# EAGLE design PiKVM_USB_Adapter v1.6 (EAGLE 9.6.2)
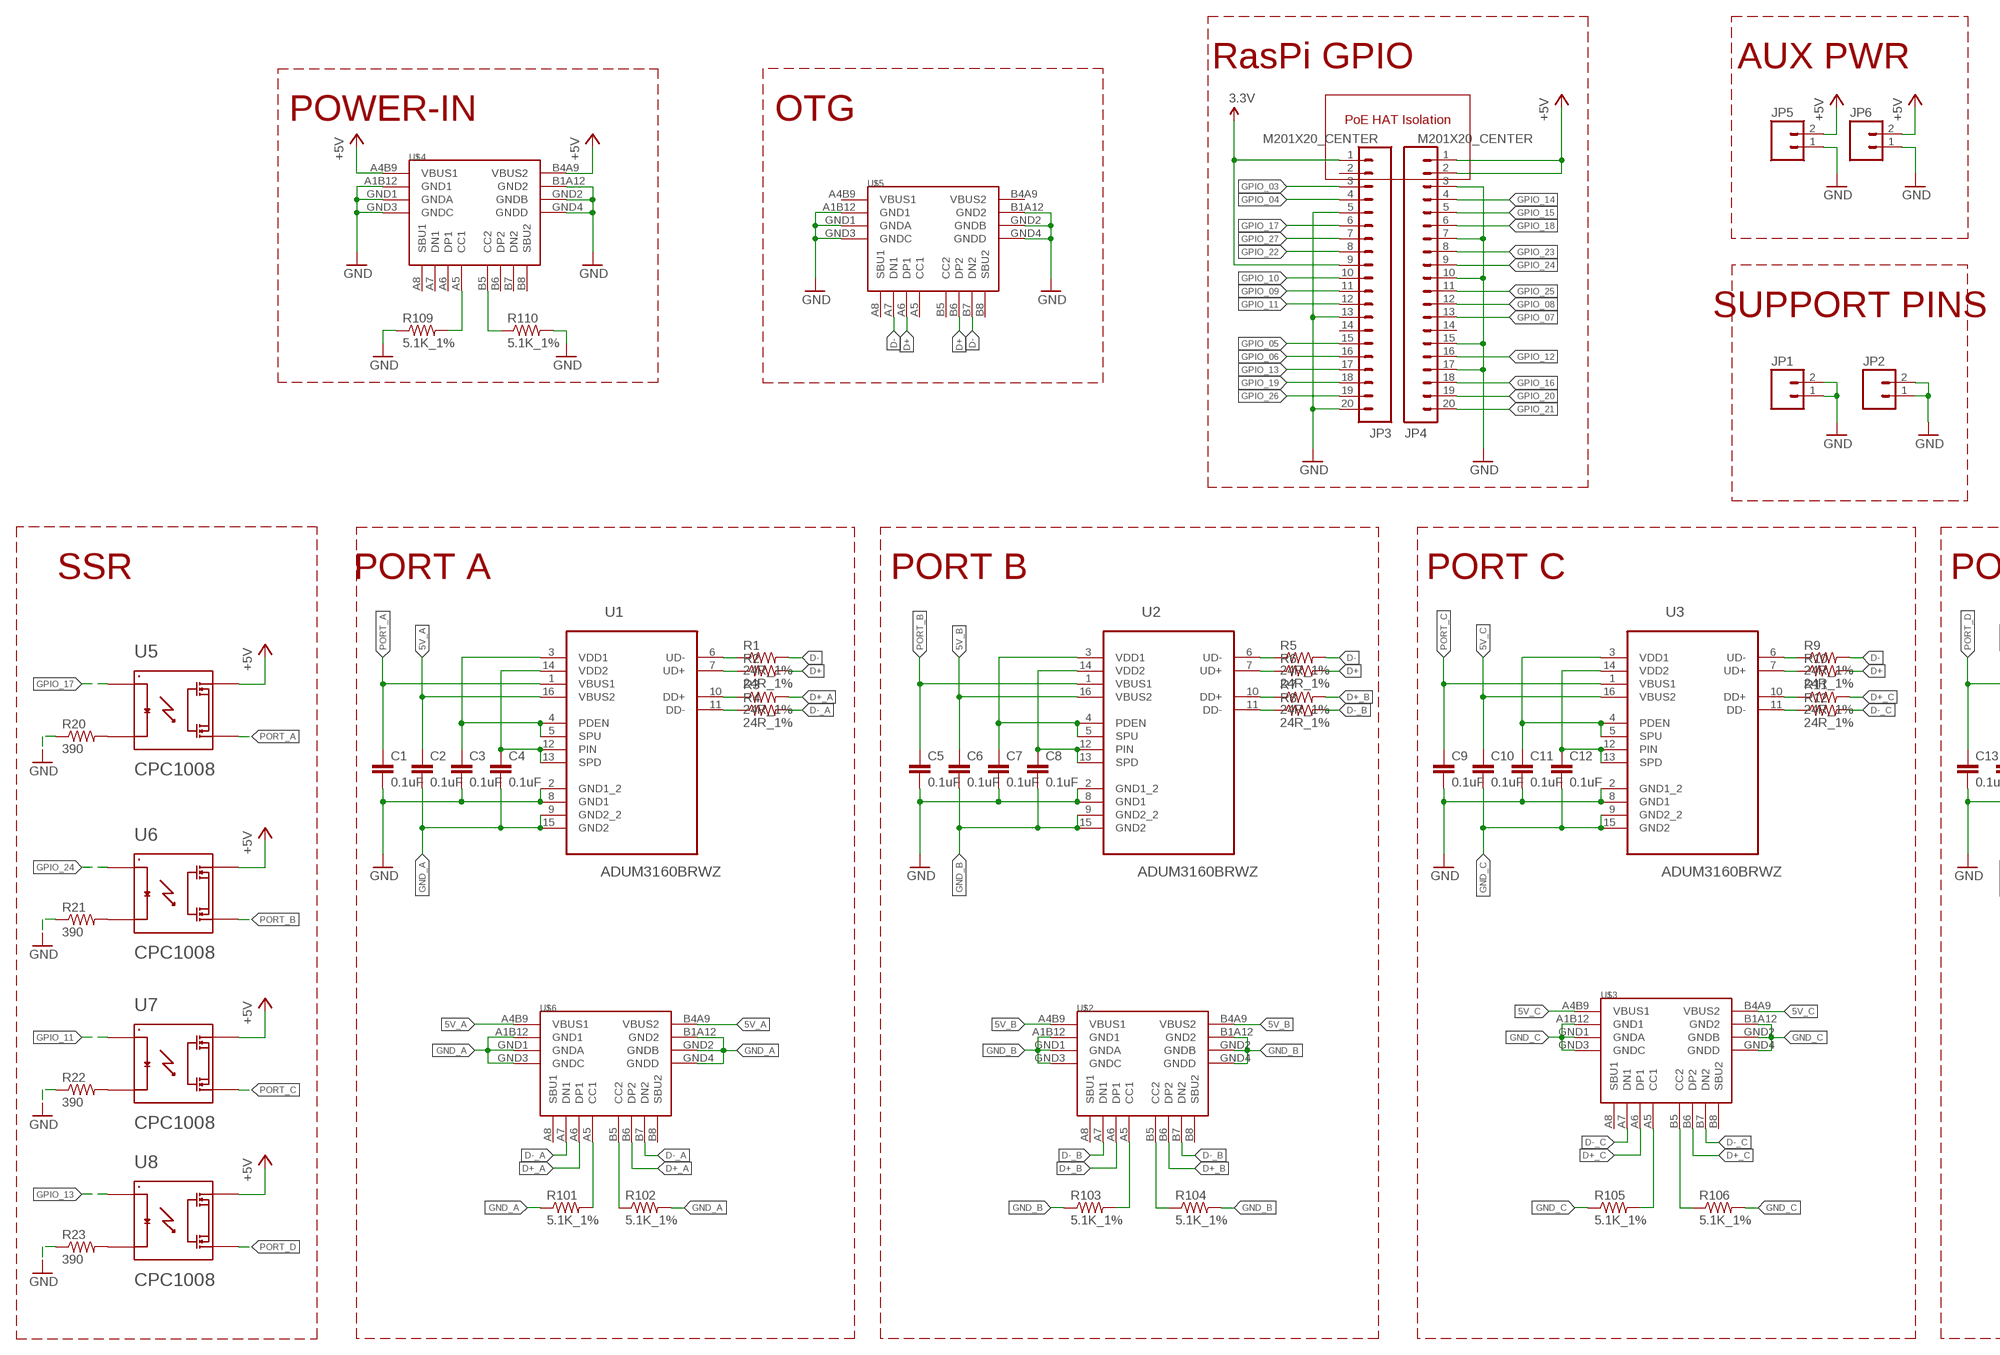
[diagram p0: schematic, sheet 1, part 1 of 2]
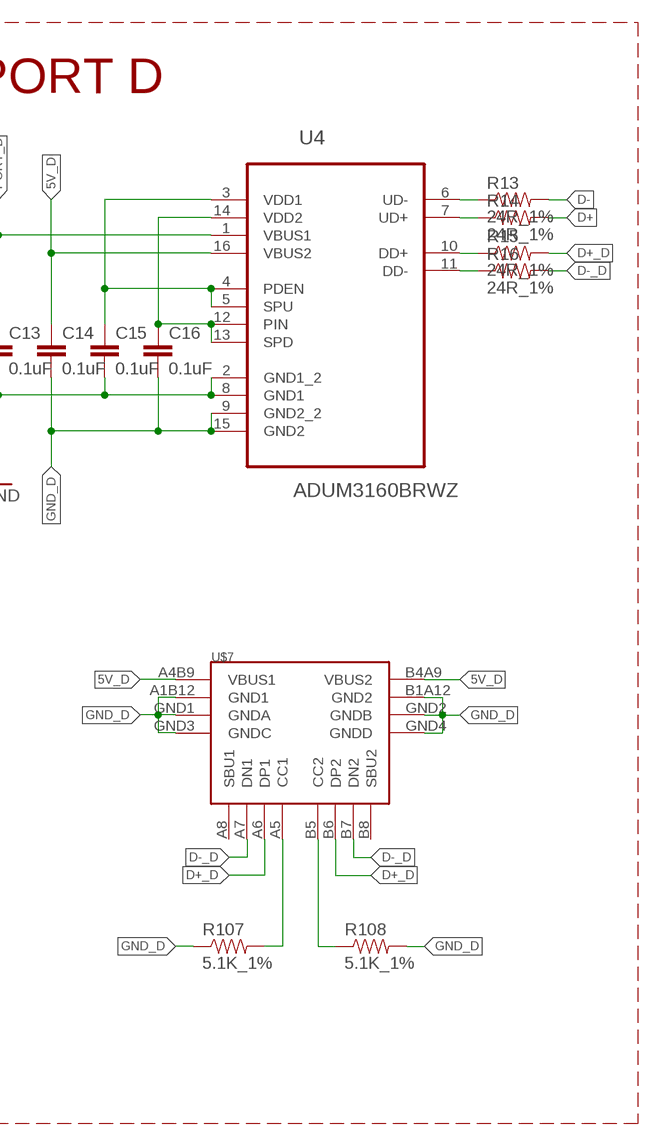
[diagram p1: schematic, sheet 1, part 2 of 2]

## Parts
C1  0.1uF  CAP0805  [0805]
C2  0.1uF  CAP0805  [0805]
C3  0.1uF  CAP0805  [0805]
C4  0.1uF  CAP0805  [0805]
C5  0.1uF  CAP0805  [0805]
C6  0.1uF  CAP0805  [0805]
C7  0.1uF  CAP0805  [0805]
C8  0.1uF  CAP0805  [0805]
C9  0.1uF  CAP0805  [0805]
C10  0.1uF  CAP0805  [0805]
C11  0.1uF  CAP0805  [0805]
C12  0.1uF  CAP0805  [0805]
C13  0.1uF  CAP0805  [0805]
C14  0.1uF  CAP0805  [0805]
C15  0.1uF  CAP0805  [0805]
C16  0.1uF  CAP0805  [0805]
JP1  M02LOCK  [1X02_LOCK]
JP2  M02LOCK  [1X02_LOCK]
JP3  M201X20_CENTER  [1X20_CENTER]
JP4  M201X20_CENTER  [1X20_CENTER]
JP5  M02LOCK  [1X02_LOCK]
JP6  M02LOCK  [1X02_LOCK]
R1  24R_1%  RESISTOR0805-RES  [0805]
R2  24R_1%  RESISTOR0805-RES  [0805]
R3  24R_1%  RESISTOR0805-RES  [0805]
R4  24R_1%  RESISTOR0805-RES  [0805]
R5  24R_1%  RESISTOR0805-RES  [0805]
R6  24R_1%  RESISTOR0805-RES  [0805]
R7  24R_1%  RESISTOR0805-RES  [0805]
R8  24R_1%  RESISTOR0805-RES  [0805]
R9  24R_1%  RESISTOR0805-RES  [0805]
R10  24R_1%  RESISTOR0805-RES  [0805]
R11  24R_1%  RESISTOR0805-RES  [0805]
R12  24R_1%  RESISTOR0805-RES  [0805]
R13  24R_1%  RESISTOR0805-RES  [0805]
R14  24R_1%  RESISTOR0805-RES  [0805]
R15  24R_1%  RESISTOR0805-RES  [0805]
R16  24R_1%  RESISTOR0805-RES  [0805]
R20  390  RESISTOR1206  [1206]
R21  390  RESISTOR1206  [1206]
R22  390  RESISTOR1206  [1206]
R23  390  RESISTOR1206  [1206]
R101  5.1K_1%  RESISTOR0805-RES  [0805]
R102  5.1K_1%  RESISTOR0805-RES  [0805]
R103  5.1K_1%  RESISTOR0805-RES  [0805]
R104  5.1K_1%  RESISTOR0805-RES  [0805]
R105  5.1K_1%  RESISTOR0805-RES  [0805]
R106  5.1K_1%  RESISTOR0805-RES  [0805]
R107  5.1K_1%  RESISTOR0805-RES  [0805]
R108  5.1K_1%  RESISTOR0805-RES  [0805]
R109  5.1K_1%  RESISTOR0805-RES  [0805]
R110  5.1K_1%  RESISTOR0805-RES  [0805]
U1  ADUM3160BRWZ  [SOIC127P1032X265-16N]
U2  ADUM3160BRWZ  [SOIC127P1032X265-16N]
U3  ADUM3160BRWZ  [SOIC127P1032X265-16N]
U4  ADUM3160BRWZ  [SOIC127P1032X265-16N]
U5  CPC1008  [SOP-4]
U6  CPC1008  [SOP-4]
U7  CPC1008  [SOP-4]
U8  CPC1008  [SOP-4]
U$2  USB4110GFA  [GCT_USB4110GFA]
U$3  USB4110GFA  [GCT_USB4110GFA]
U$4  USB4110GFA  [GCT_USB4110GFA]
U$5  USB4110GFA  [GCT_USB4110GFA]
U$6  USB4110GFA  [GCT_USB4110GFA]
U$7  USB4110GFA  [GCT_USB4110GFA]

## Nets
3.3V: JP3.1 JP3.9
5V_A: C2.1 U1.16(VBUS2) U$6.A4B9(VBUS1) U$6.B4A9(VBUS2)
5V_B: C6.1 U2.16(VBUS2) U$2.A4B9(VBUS1) U$2.B4A9(VBUS2)
5V_C: C10.1 U3.16(VBUS2) U$3.A4B9(VBUS1) U$3.B4A9(VBUS2)
5V_D: C14.1 U4.16(VBUS2) U$7.A4B9(VBUS1) U$7.B4A9(VBUS2)
+5V: JP4.1 JP4.2 JP5.2 JP6.2 U5.P$4 U6.P$4 U7.P$4 U8.P$4 U$4.A4B9(VBUS1) U$4.B4A9(VBUS2)
D+: R2.2 R6.2 R10.2 R14.2 U$5.A6(DP1) U$5.B6(DP2)
D+_A: R3.2 U$6.A6(DP1) U$6.B6(DP2)
D+_B: R7.2 U$2.A6(DP1) U$2.B6(DP2)
D+_C: R11.2 U$3.A6(DP1) U$3.B6(DP2)
D+_D: R15.2 U$7.A6(DP1) U$7.B6(DP2)
D-: R1.2 R5.2 R9.2 R13.2 U$5.A7(DN1) U$5.B7(DN2)
D-_A: R4.2 U$6.A7(DN1) U$6.B7(DN2)
D-_B: R8.2 U$2.A7(DN1) U$2.B7(DN2)
D-_C: R12.2 U$3.A7(DN1) U$3.B7(DN2)
D-_D: R16.2 U$7.A7(DN1) U$7.B7(DN2)
GND: C1.2 C3.2 C5.2 C7.2 C9.2 C11.2 C13.2 C15.2 JP1.1 JP1.2 JP2.1 JP2.2 JP3.5 JP3.13 JP3.20 JP4.3 JP4.7 JP4.10 JP4.15 JP4.17 JP5.1 JP6.1 R20.1 R21.1 R22.1 R23.1 R109.1 R110.2 U1.2(GND1_2) U1.8(GND1) U2.2(GND1_2) U2.8(GND1) U3.2(GND1_2) U3.8(GND1) U4.2(GND1_2) U4.8(GND1) U$4.A1B12(GND1) U$4.B1A12(GND2) U$4.GND1(GNDA) U$4.GND2(GNDB) U$4.GND3(GNDC) U$4.GND4(GNDD) U$5.A1B12(GND1) U$5.B1A12(GND2) U$5.GND1(GNDA) U$5.GND2(GNDB) U$5.GND3(GNDC) U$5.GND4(GNDD)
GND_A: C2.2 C4.2 R101.1 R102.2 U1.9(GND2_2) U1.15(GND2) U$6.A1B12(GND1) U$6.B1A12(GND2) U$6.GND1(GNDA) U$6.GND2(GNDB) U$6.GND3(GNDC) U$6.GND4(GNDD)
GND_B: C6.2 C8.2 R103.1 R104.2 U2.9(GND2_2) U2.15(GND2) U$2.A1B12(GND1) U$2.B1A12(GND2) U$2.GND1(GNDA) U$2.GND2(GNDB) U$2.GND3(GNDC) U$2.GND4(GNDD)
GND_C: C10.2 C12.2 R105.1 R106.2 U3.9(GND2_2) U3.15(GND2) U$3.A1B12(GND1) U$3.B1A12(GND2) U$3.GND1(GNDA) U$3.GND2(GNDB) U$3.GND3(GNDC) U$3.GND4(GNDD)
GND_D: C14.2 C16.2 R107.1 R108.2 U4.9(GND2_2) U4.15(GND2) U$7.A1B12(GND1) U$7.B1A12(GND2) U$7.GND1(GNDA) U$7.GND2(GNDB) U$7.GND3(GNDC) U$7.GND4(GNDD)
GPIO_03: JP3.3
GPIO_04: JP3.4
GPIO_05: JP3.15
GPIO_06: JP3.16
GPIO_07: JP4.13
GPIO_08: JP4.12
GPIO_09: JP3.11
GPIO_10: JP3.10
GPIO_11: JP3.12 U7.P$1
GPIO_12: JP4.16
GPIO_13: JP3.17 U8.P$1
GPIO_14: JP4.4
GPIO_15: JP4.5
GPIO_16: JP4.18
GPIO_17: JP3.6 U5.P$1
GPIO_18: JP4.6
GPIO_19: JP3.18
GPIO_20: JP4.19
GPIO_21: JP4.20
GPIO_22: JP3.8
GPIO_23: JP4.8
GPIO_24: JP4.9 U6.P$1
GPIO_25: JP4.11
GPIO_26: JP3.19
GPIO_27: JP3.7
N$1: C8.1 U2.12(PIN) U2.13(SPD) U2.14(VDD2)
N$2: R5.1 U2.6(UD-)
N$3: R6.1 U2.7(UD+)
N$4: R7.1 U2.10(DD+)
N$5: R20.2 U5.P$2
N$6: R8.1 U2.11(DD-)
N$7: C3.1 U1.3(VDD1) U1.4(PDEN) U1.5(SPU)
N$8: R101.2 U$6.A5(CC1)
N$9: C12.1 U3.12(PIN) U3.13(SPD) U3.14(VDD2)
N$10: R9.1 U3.6(UD-)
N$11: R10.1 U3.7(UD+)
N$12: R11.1 U3.10(DD+)
N$13: R12.1 U3.11(DD-)
N$14: R102.1 U$6.B5(CC2)
N$15: R108.1 U$7.B5(CC2)
N$16: C16.1 U4.12(PIN) U4.13(SPD) U4.14(VDD2)
N$17: R13.1 U4.6(UD-)
N$18: R107.2 U$7.A5(CC1)
N$19: C4.1 U1.12(PIN) U1.13(SPD) U1.14(VDD2)
N$20: R14.1 U4.7(UD+)
N$21: R15.1 U4.10(DD+)
N$22: R16.1 U4.11(DD-)
N$23: R1.1 U1.6(UD-)
N$24: R2.1 U1.7(UD+)
N$25: R3.1 U1.10(DD+)
N$26: R4.1 U1.11(DD-)
N$27: R105.2 U$3.A5(CC1)
N$28: R106.1 U$3.B5(CC2)
N$31: R21.2 U6.P$2
N$32: R22.2 U7.P$2
N$33: R23.2 U8.P$2
N$34: C7.1 U2.3(VDD1) U2.4(PDEN) U2.5(SPU)
N$35: R104.1 U$2.B5(CC2)
N$36: C11.1 U3.3(VDD1) U3.4(PDEN) U3.5(SPU)
N$37: C15.1 U4.3(VDD1) U4.4(PDEN) U4.5(SPU)
N$38: R103.2 U$2.A5(CC1)
N$39: R109.2 U$4.A5(CC1)
N$40: R110.1 U$4.B5(CC2)
PORT_A: C1.1 U1.1(VBUS1) U5.P$3
PORT_B: C5.1 U2.1(VBUS1) U6.P$3
PORT_C: C9.1 U3.1(VBUS1) U7.P$3
PORT_D: C13.1 U4.1(VBUS1) U8.P$3
Unconnected: JP3.2 JP3.14 JP4.14 U$2.A8(SBU1) U$2.B8(SBU2) U$3.A8(SBU1) U$3.B8(SBU2) U$4.A6(DP1) U$4.A7(DN1) U$4.A8(SBU1) U$4.B6(DP2) U$4.B7(DN2) U$4.B8(SBU2) U$5.A5(CC1) U$5.A8(SBU1) U$5.B5(CC2) U$5.B8(SBU2) U$6.A8(SBU1) U$6.B8(SBU2) U$7.A8(SBU1) U$7.B8(SBU2)

## Notes on the sheet
- RasPi GPIO | AUX PWR
- POWER-IN | OTG
- PoE HAT Isolation
- SUPPORT PINS
- SSR | PORT A | PORT B | PORT C | PORT D

## Power pins joined to a net without a drawn wire
VBUS1: U$5.A4B9(VBUS1)
VBUS2: U$5.B4A9(VBUS2)

## Library data of the parts
C1-C16 = SparkFun-Capacitors:CAP: Capacitor Standard 0603 ceramic capacitor, and 0.1" leaded capacitor.
JP1 JP2 JP5 JP6 = SparkFun-Connectors:M02: Header 2 Standard 2-pin 0.1" header. Use with straight break away headers (SKU : PRT-00116), right angle break away headers (PRT-00553), swiss pins (PRT-00743), machine pins (PRT-00117), and female headers (PRT-00115). Molex polarized connector foot print use with SKU : PRT-08233 with associated crimp pins and housings.
JP3 JP4 = SparkFun-Connectors:M20: 1x20 .1" header This is just like the LOCK variant in that the holes are staggared by 5 mil, but except for the last two holes. They are not altered from the "standard" footprint layout. This is used for a special purpose on the layout of our Graphic LCD Backpack. Make sure you want to use this device before selecting it for you project!
R1-R16 R20-R23 R101-R110 = SparkFun-Resistors:RESISTOR: Resistor Basic schematic elements and footprints for 0603, 1206, and PTH resistors.
U1-U4 = Analog Devices_By_element14_Batch_1:ADUM3160BRWZ: Full/Low Speed 2.5 kV USB Digital Isolator; MPN: ADUM3160BRWZ; OC_FARNELL: 1843660; OC_NEWARK: 85R6420; PACKAGE: SOIC-16; SUPPLIER: Analog Devices
U5-U8 = MyLib2:CPC1008
U$2-U$7 = MY_adafruit:USB4110GFA

## Board
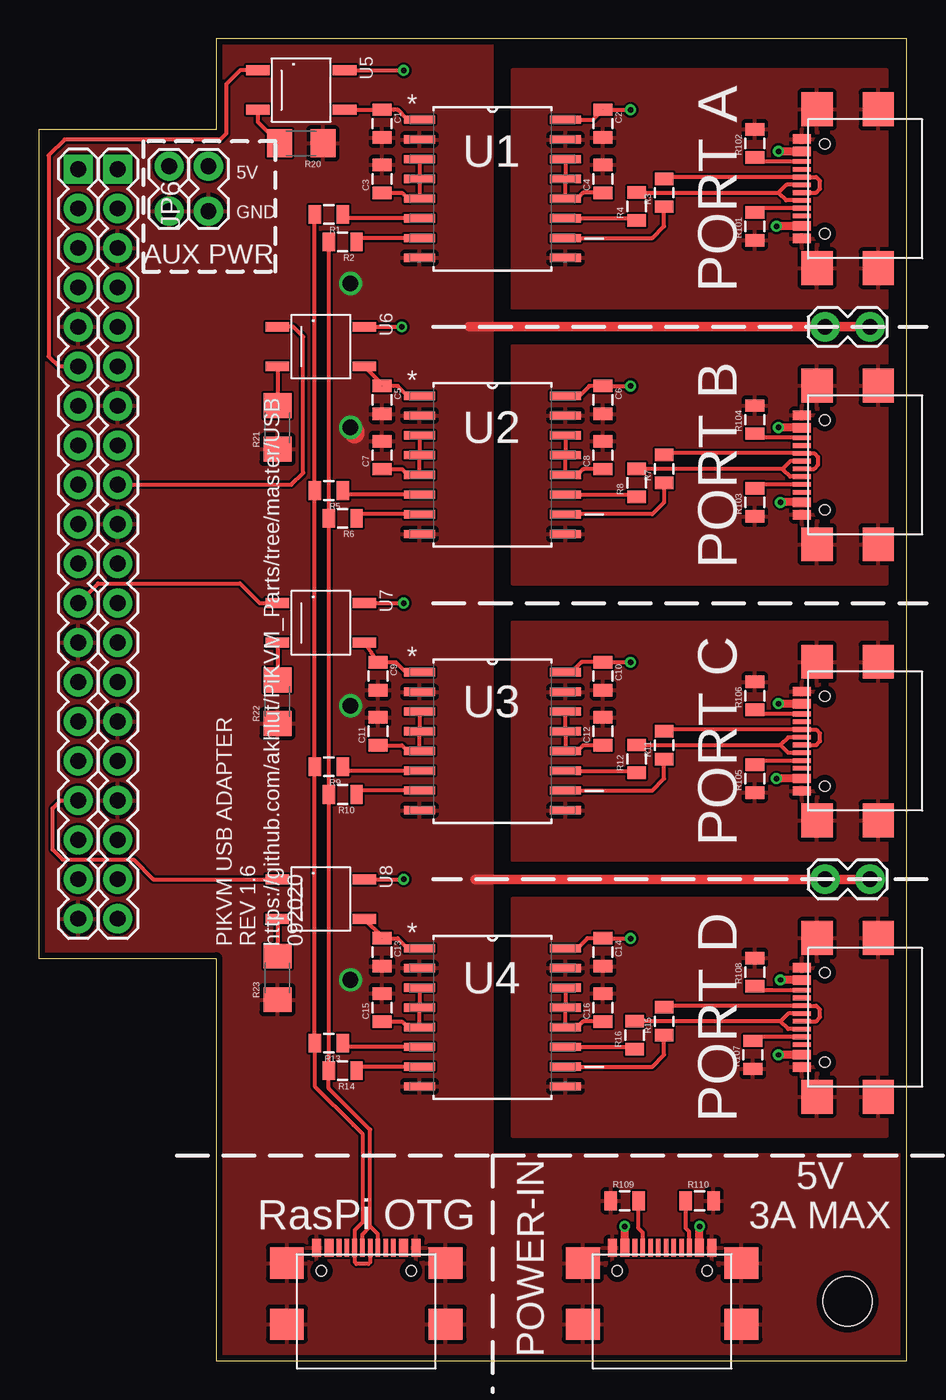
[diagram p2: board, top side]
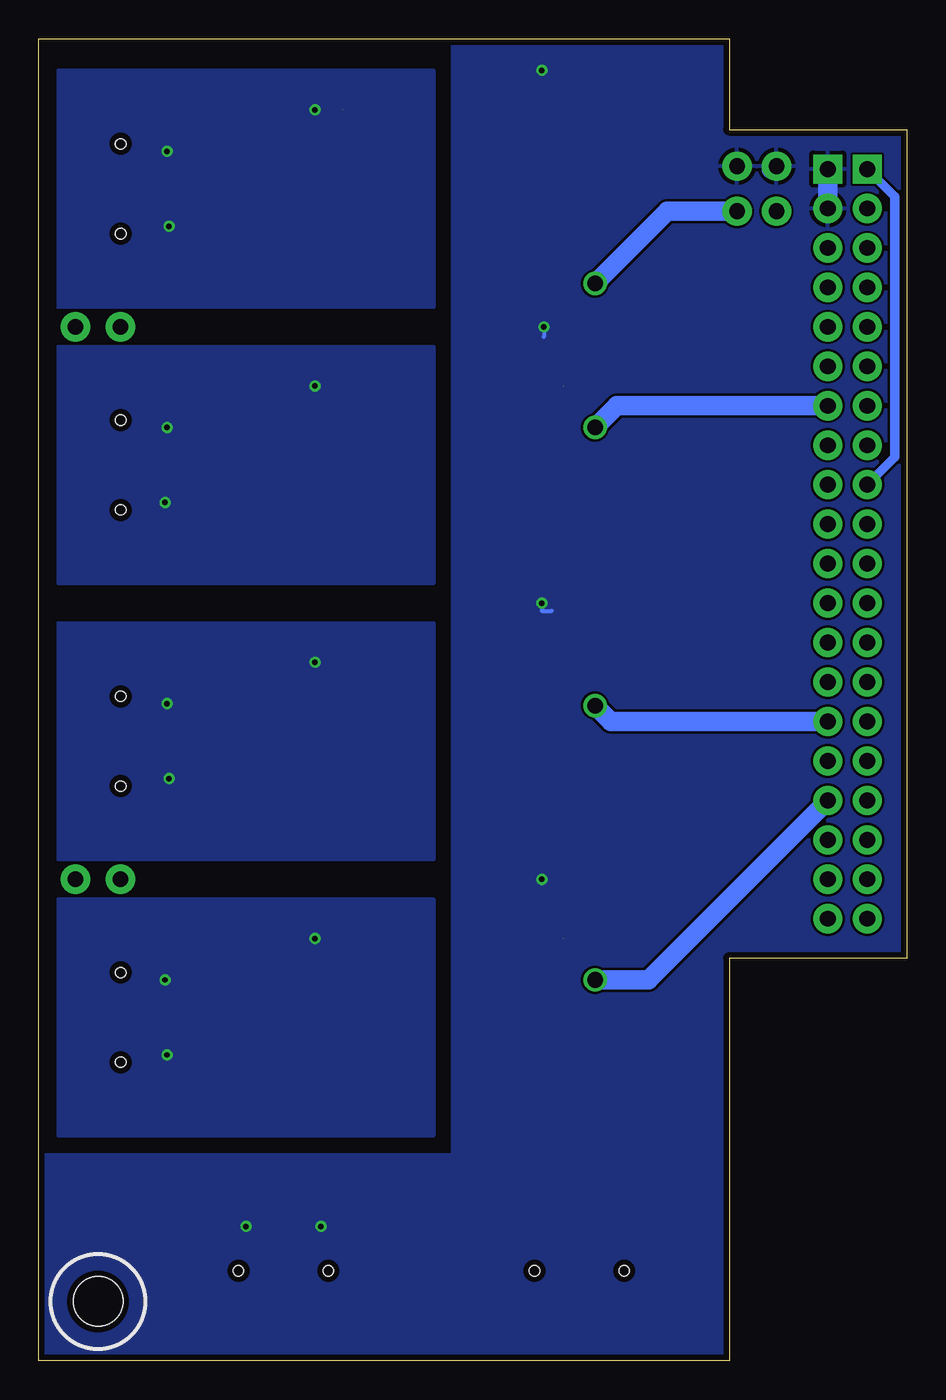
[diagram p3: board, bottom side, seen from below]

Size 55.88 x 85.09 mm. Coordinates in mm from the lower left corner, seen from the top.
Outline: 0,25.91 11.43,25.91 11.43,0 55.88,0 55.88,85.09 11.43,85.09 11.43,79.25 0,79.25 0,25.91
Copper layers (1*16): Top 0.0356mm / dielectric 1.5011mm / Bottom 0.0356mm
Design rules "LaenPCBOrder": minimum track width 6mil, minimum drill 13mil, track to track 6mil, track to pad 6mil, pad to pad 6mil, via to via 6mil, smd to smd 6mil, copper to edge 15mil, drill to drill 6mil, minimum pad ring 7mil, minimum via ring 7mil, stop-mask expansion 3mil, vias tented up to drill 0mil, thermal gap 10mil
Holes 3.17 mm at 52.07,3.81

### Footprints (pad centres in the part's own frame; a part is rotated, then mirrored left to right if it is on the bottom)
0805 = smd 0.8 x 1.2: 1 -0.9,0; 2 0.9,0
1X02_LOCK = drill 1.016 pad 1.88: 1 -0.178,0; 2 2.718,0
1X20_CENTER = drill 1.016 pad 1.88 square: 1 -24.13,0 | drill 1.016 pad 1.88: 2 -21.59,0; 3 -19.05,0; 4 -16.51,0; 5 -13.97,0; 6 -11.43,0; 7 -8.89,0; 8 -6.35,0; 9 -3.81,0; 10 -1.27,0; 11 1.27,0; 12 3.81,0; 13 6.35,0; 14 8.89,0; 15 11.43,0; 16 13.97,0; 17 16.51,0; 18 19.05,0; 19 21.59,0; 20 24.13,0
1206 = smd 1.6 x 1.8: 1 -1.4,0; 2 1.4,0
SOIC127P1032X265-16N = smd 1.981 x 0.533: 1 -4.699,4.445; 2 -4.699,3.175; 3 -4.699,1.905; 4 -4.699,0.635; 5 -4.699,-0.635; 6 -4.699,-1.905; 7 -4.699,-3.175; 8 -4.699,-4.445; 9 4.699,-4.445; 10 4.699,-3.175; 11 4.699,-1.905; 12 4.699,-0.635; 13 4.699,0.635; 14 4.699,1.905; 15 4.699,3.175; 16 4.699,4.445
SOP-4 = smd 0.635 x 1.524: P$1 -1.27,-2.794; P$2 1.27,-2.794; P$3 1.27,2.794; P$4 -1.27,2.794
GCT_USB4110GFA = smd 0.6 x 1.15: A1B12 -3.2,0.4; A4B9 -2.4,0.4; B1A12 3.2,0.4; B4A9 2.4,0.4 | smd 0.3 x 1.15: A5 -1.25,0.4; A6 -0.25,0.4; A7 0.25,0.4; A8 1.25,0.4; B5 1.75,0.4; B6 0.75,0.4; B7 -0.75,0.4; B8 -1.75,0.4 | smd 2.18 x 2: GND1 -5.11,-0.575; GND2 -5.11,-4.505; GND3 5.11,-0.575; GND4 5.11,-4.505 | hole 0.65: -2.89,-1.075; 2.89,-1.075

### Placement (x,y rotation side)
C1  22.1,79.63 270 top
C2  36.32,79.63 270 top
C3  22.1,76.07 90 top
C4  36.32,76.07 90 top
C5  22.1,61.85 270 top
C6  36.32,61.85 270 top
C7  22.1,58.29 90 top
C8  36.32,58.29 90 top
C9  21.84,44.07 270 top
C10  36.32,44.07 270 top
C11  21.84,40.51 90 top
C12  36.32,40.51 90 top
C13  22.1,26.29 270 top
C14  36.32,26.29 270 top
C15  22.1,22.73 90 top
C16  36.32,22.73 90 top
JP1  50.8,66.55 0 top
JP2  50.8,30.99 0 top
JP3  2.54,52.58 270 top
JP4  5.08,52.58 270 top
JP5  8.38,74.17 90 top
JP6  10.92,74.17 90 top
R1  18.67,73.79 180 top
R2  19.56,72.01 180 top
R3  40.26,75.18 90 top
R4  38.48,74.3 90 top
R5  18.67,56.01 180 top
R6  19.56,54.23 180 top
R7  40.26,57.4 90 top
R8  38.48,56.52 90 top
R9  18.67,38.23 180 top
R10  19.56,36.45 180 top
R11  40.26,39.62 90 top
R12  38.48,38.73 90 top
R13  18.67,20.45 180 top
R14  19.56,18.67 180 top
R15  40.26,21.84 90 top
R16  38.35,20.95 90 top
R20  16.89,78.36 180 top
R21  15.37,60.07 90 top
R22  15.37,42.42 90 top
R23  15.37,24.64 90 top
R101  46.1,73.03 90 top
R102  46.1,78.36 90 top
R103  46.1,55.24 90 top
R104  46.1,60.58 90 top
R105  46.1,37.47 90 top
R106  46.1,42.8 90 top
R107  45.97,19.68 90 top
R108  46.1,25.02 90 top
R109  37.72,10.29 0 top
R110  42.55,10.29 0 top
U1  29.21,75.44 0 top
U2  29.21,57.66 0 top
U3  29.21,39.88 0 top
U4  29.21,22.1 0 top
U5  16.89,81.79 270 top
U6  18.16,65.28 270 top
U7  18.16,47.5 270 top
U8  18.16,29.72 270 top
U$2  49.53,57.66 90 top
U$3  49.53,39.88 90 top
U$4  40.13,6.86 0 top
U$5  21.08,6.86 0 top
U$6  49.53,75.44 90 top
U$7  49.53,22.1 90 top

### Tracks (layer width: path | path; a pad name or v marks a point on that pad's centre or on a via)
3.3V
  Bottom 0.61: JP3.1 0.76,74.93 0.76,58.17 JP3.9
5V_A  (via drill 0.35)  (1 unrouted)
  Top 0.254: 33.92,79.89 U1.16 35.68,79.88 C2.1 37.96,80.53 v38.1,80.52
  Top 0.305: U$6.A4B9 49.12,73.03 | 47.64,77.84 v47.62,77.85
  Top 0.508: 49.12,73.03 v47.5,73.03 | U$6.B4A9 47.64,77.84
  Bottom 0.254: v38.1,80.52 38.23,80.52
  pour Bottom: 30.48,67.82 54.61,67.82 54.61,83.06 30.48,83.06
5V_B  (via drill 0.35)
  Top 0.254: v38.1,62.74 38.09,62.75 C6.1 35.44,62.75 34.8,62.1 U2.16
  Top 0.305: 47.64,60.06 v47.62,60.07 | 47.77,55.26 v47.75,55.24
  Top 0.508: U$2.B4A9 47.64,60.06 | U$2.A4B9 47.77,55.26
  pour Bottom: 30.48,50.04 54.61,50.04 54.61,65.28 30.48,65.28
5V_C  (via drill 0.35)
  Top 0.254: U3.16 34.29,44.32 34.94,44.97 C10.1 37.84,44.97 v38.1,44.96
  Top 0.305: U$3.A4B9 49.12,37.47 | 47.64,42.28 v47.62,42.29
  Top 0.508: 49.12,37.47 v47.5,37.47 | U$3.B4A9 47.64,42.28
  pour Bottom: 30.48,32.26 54.61,32.26 54.61,47.5 30.48,47.5
5V_D  (via drill 0.35)
  Top 0.254: U4.16 34.67,26.54 35.32,27.19 C14.1 38.09,27.19 v38.1,27.18
  Top 0.305: 47.75,24.5 v47.75,24.51
  Top 0.508: U$7.B4A9 47.75,24.5 | U$7.A4B9 49.12,19.68 v47.62,19.68
  pour Bottom: 30.48,14.48 54.61,14.48 54.61,29.72 30.48,29.72
+5V  (via drill 0.35)
  Top 0.254: U5.P$4 v23.5,83.06 | U6.P$4 v23.37,66.55 | U7.P$4 v23.5,48.77 | U8.P$4 v23.5,30.99
  Top 0.508: U$4.A4B9 37.73,8.64 | U$4.B4A9 42.53,8.64
  Top 0.61: 37.73,8.64 v37.72,8.64 | 42.53,8.64 v42.55,8.64
  Bottom 0.254: v23.37,66.55 23.37,65.91 | v23.5,48.77 23.5,48.26 22.86,48.26
  Bottom 1.27: JP4.2 JP4.1 | 8.71,76.71 JP5.2
  pour Bottom: 3.81,13.21 57.15,13.21 57.15,0 3.81,0
  pour Bottom: 29.21,86.36 0,86.36 0,11.43 29.21,11.43
  pour Bottom: 29.21,87.63 -1.27,87.63 -1.27,69.85 29.21,69.85
D+
  Top 0.254: 18.67,72 R2.2 R6.2 | R6.2 18.67,54.22 | R6.2 R10.2 R14.2 18.66,17.54 21.34,14.86 21.34,8.64 | U$5.A6 20.83,8.13 21.34,8.64 | U$5.B6 21.83,8.14 21.34,8.64
D+_A
  Top 0.254: U$6.A6 50.04,75.19 50.29,75.44 50.29,75.95 50.05,76.19 U$6.B6 40.36,76.19 R3.2
D+_B
  Top 0.203: 49.12,58.42 U$2.B6
  Top 0.254: R7.2 40.36,58.41 U$2.B6 49.92,58.41 50.16,58.17 50.16,57.66 49.91,57.41 U$2.A6
D+_C
  Top 0.203: U$3.A6
  Top 0.254: R11.2 40.36,40.63 U$3.B6 50.05,40.63 50.29,40.39 50.29,39.88 50.04,39.63 U$3.A6
D+_D
  Top 0.254: U$7.A6 50.04,21.85 50.29,22.1 50.29,22.61 50.05,22.85 U$7.B6 40.36,22.85 R15.2
D-
  Top 0.254: U$5.A7 21.33,6.35 21.21,6.22 20.45,6.22 20.33,6.34 U$5.B7 20.33,8.39 20.83,8.89 20.83,14.61 20.33,15.1 20.26,15.18 17.77,17.66 R13.2 R9.2 R5.2 R1.2
D-_A
  Top 0.254: U$6.A7 48.13,75.69 47.62,75.18 | U$6.B7 48.12,74.69 47.62,75.18 | R4.2 47.61,75.19 47.62,75.18
D-_B
  Top 0.203: 49.14,56.9 U$2.B7
  Top 0.254: U$2.A7 48.38,57.91 47.88,57.4 | U$2.B7 48.38,56.91 47.94,57.34 47.88,57.4 | R8.2 47.87,57.41 47.88,57.4
D-_C
  Top 0.254: 49.12,39.12 U$3.B7 48.25,39.13 47.75,39.62 | U$3.A7 48.26,40.13 47.75,39.62 | R12.2 47.74,39.63 47.75,39.62
D-_D
  Top 0.203: 49.14,21.34 U$7.B7
  Top 0.254: U$7.B7 48.25,21.35 47.75,21.84 | U$7.A7 48.26,22.35 47.75,21.84 | R16.2 38.37,21.84 47.75,21.84
GND  (via drill 1)
  Top 0.61: U$5.GND3 26.61,6.7 | 28.07,30.99 JP2.1 JP2.2 | JP1.2 JP1.1 27.69,66.55
  Top 1.27: v20.07,60.07 20.32,59.82 20.32,59.69
  Bottom 1.27: JP4.7 18.67,61.47 v20.07,60.07 | JP4.15 19.05,41.15 v20.07,42.16 | JP4.17 16.64,24.51 v20.07,24.51 | JP6.1 15.42,73.99 v20.07,69.34
  pour Top: 29.21,85.09 0,85.09 0,0 29.21,0
  pour Top: 11.43,13.21 11.43,0 55.88,0 55.88,13.21
GND_A
  pour Top: 30.48,83.06 30.48,67.82 54.61,67.82 54.61,83.06
GND_B
  pour Top: 30.48,65.28 30.48,50.04 54.61,50.04 54.61,65.28
GND_C
  pour Top: 30.48,47.5 30.48,32.26 54.61,32.26 54.61,47.5
GND_D
  pour Top: 30.48,29.72 30.48,14.48 54.61,14.48 54.61,29.72
GPIO_11
  Top 0.254: JP3.12 3.81,50.04 12.95,50.04 14.22,48.77 U7.P$1
GPIO_13
  Top 0.254: 15.24,30.86 U8.P$1 7.37,30.99 6.1,32.26 1.52,32.26 0.89,32.89 0.89,35.56 1.4,36.07 JP3.17
GPIO_17
  Top 0.254: U5.P$1 12.95,83.06 12.06,82.17 12.06,78.99 11.68,78.61 1.65,78.61 0.64,77.6 0.64,64.64 1.27,64.01 JP3.6
GPIO_24
  Top 0.254: JP4.9 16.26,56.39 17.02,57.15 17.02,65.91 16.38,66.55 U6.P$1
N$1
  Top 0.254: U2.14 U2.13 U2.12 34.67,57.02 35.04,57.39 C8.1
N$2
  Top 0.254: U2.6 19.82,55.75 R5.1
N$3
  Top 0.254: U2.7 20.71,54.48 R6.1
N$4
  Top 0.254: R7.1 40.26,55.24 39.5,54.48 U2.10
N$5
  Top 0.254: U5.P$2 14.1,79.75 R20.2
N$6
  Top 0.254: U2.11 38.34,55.75 R8.1
N$7
  Top 0.254: U1.3 U1.4 U1.5 23.75,74.8 23.38,75.17 C3.1
N$8
  Top 0.254: U$6.A5 46.36,74.19 R101.2
N$9
  Top 0.254: U3.14 U3.13 U3.12 34.67,39.24 35.04,39.61 C12.1
N$10
  Top 0.254: U3.6 19.82,37.97 R9.1
N$11
  Top 0.254: U3.7 20.71,36.7 R10.1
N$12
  Top 0.254: U3.10 39.5,36.7 40.26,37.47 R11.1
N$13
  Top 0.254: U3.11 38.34,37.97 R12.1
N$14
  Top 0.254: U$6.B5 46.37,77.19 R102.1
N$15
  Top 0.254: U$7.B5 46.37,23.85 R108.1
N$16
  Top 0.254: U4.14 U4.13 U4.12 34.67,21.46 35.04,21.83 C16.1
N$17
  Top 0.254: U4.6 19.82,20.19 R13.1
N$18
  Top 0.254: U$7.A5 46.24,20.85 R107.2
N$19
  Top 0.254: U1.12 | U1.14 U1.13 U1.12 | C4.1 35.04,75.17 34.67,74.8 U1.12
N$20
  Top 0.254: U4.7 20.71,18.92 R14.1
N$21
  Top 0.254: U4.10 39.5,18.92 40.26,19.68 R15.1
N$22
  Top 0.254: U4.11 38.22,20.19 R16.1
N$23
  Top 0.254: U1.6 19.82,73.53 R1.1
N$24
  Top 0.254: U1.7 20.71,72.26 R2.1
N$25
  Top 0.254: R3.1 40.26,73.03 39.5,72.26 U1.10
N$26
  Top 0.254: U1.11 38.34,73.53 R4.1
N$27
  Top 0.254: U$3.A5 49.11,38.61 46.34,38.61 R105.2
N$28
  Top 0.254: U$3.B5 46.37,41.63 R106.1
N$31
  Top 0.254: U6.P$2 R21.2
N$32
  Top 0.254: U7.P$2 R22.2
N$33
  Top 0.254: U8.P$2 R23.2
N$34
  Top 0.254: U2.3 U2.4 U2.5 23.75,57.02 23.38,57.39 C7.1
N$35
  Top 0.254: U$2.B5 46.37,59.41 R104.1
N$36
  Top 0.254: U3.3 U3.4 U3.5 23.75,39.24 23.38,39.61 C11.1
N$37
  Top 0.254: U4.3 U4.4 U4.5 23.75,21.46 23.38,21.83 C15.1
N$38
  Top 0.254: U$2.A5 46.36,56.41 R103.2
N$39
  Top 0.254: 38.86,7.28 U$4.A5 38.88,8.23 38.61,8.51 38.61,10.28 R109.2
N$40
  Top 0.254: R110.1 41.65,8.52 41.88,8.28 U$4.B5
PORT_A
  Top 0.254: C1.1 22.1,80.52 | U1.1 23.75,79.88 23.11,80.52 22.86,80.52 22.1,80.52 | U5.P$3 22.1,80.52
PORT_B  (1 unrouted)
  Top 0.254: C5.1 22.09,62.74 | U2.1 23.75,62.1 23.1,62.75 C5.1 | U6.P$3 22.1,62.87 C5.1
PORT_C
  Top 0.254: C9.1 21.83,44.96 | C9.1 22.98,44.97 23.62,44.32 U3.1 | U7.P$3 21.41,45.59 | 21.41,45.59 C9.1 | C9.1 21.41,45.59
PORT_D  (1 unrouted)
  Top 0.254: U4.1 23.75,26.54 23.1,27.19 C13.1 | C13.1 22.09,27.18 | U8.P$3 22.1,27.3 C13.1

### Text on the board
tPlace: 5V | GND | AUX PWR
tNames: PORT A | PORT B | PORT C | PIKVM USB ADAPTER / REV 1.6 / https://github.com/akhlut/PiKVM_Parts/tree/master/USB / 092020 | PORT D | 5V | RasPi OTG | 3A MAX | POWER-IN